# Altium schematic sheet 02_IO_PORTS.SchDoc: General IO Ports
size 381 x 266 mm; Organization: Meteroi; Address1: Room 428, 410 Guiping Rd.; Address2: Shanghai 200233, CHINA; SheetNumber: 2; SheetTotal: 9; PageSetup: Record=PageOptions|CenterHorizontal=True|CenterVertical=True|PrintScale=0.75|XCorrection=1.00|YCorrection=1.00|PrintKind=2|BorderSize=5000000|LeftOffset=0|BottomOffset=0|Orientation=2|PaperLength=1000|PaperWidth=1000|Scale=100|PaperSource=276|PrintQuality=-3|MediaType=1|DitherType=10|PaperKind=A4|PrintScaleMode=1
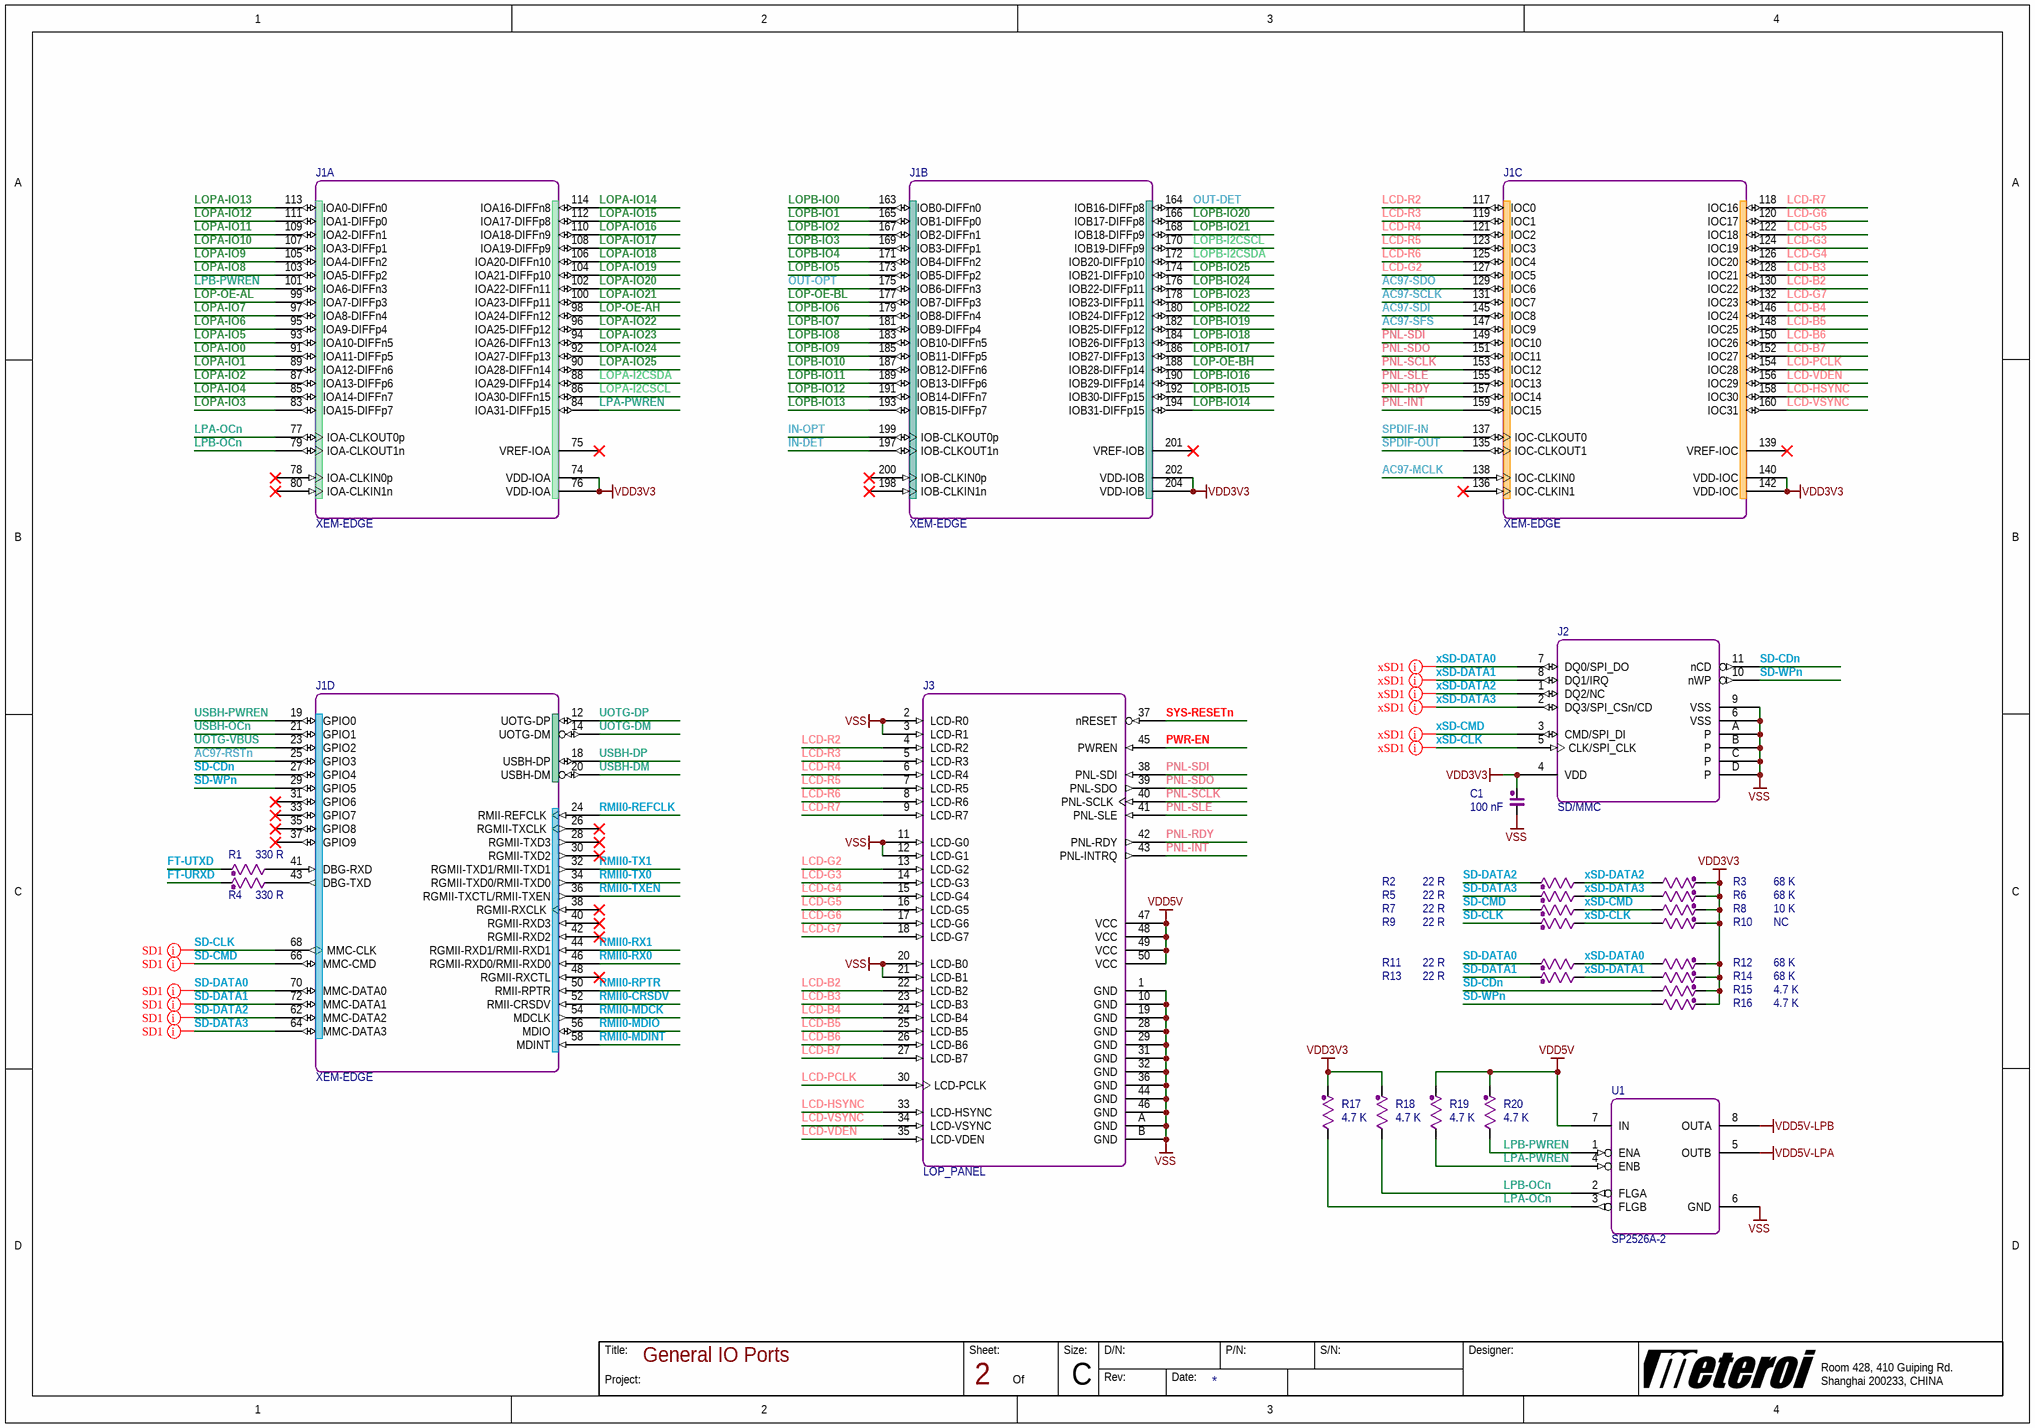
[diagram p0: 02_IO_PORTS.SchDoc]

## Parts
C1  100 nF  [0603A1]
J1  XEM-EDGE  [XEM-1S-204]  (parts A,B,C,D of 5)
J2  SD/MMC  [SD_SOCKET_C]
J3  LOP_PANEL  [FPC_0P5_50A]
R1  330 R  [0603A2]
R2  22 R  [0402A2]
R3  68 K  [0402A2]
R4  330 R  [0603A2]
R5  22 R  [0402A2]
R6  68 K  [0402A2]
R7  22 R  [0402A2]
R8  10 K  [0402A2]
R9  22 R  [0402A2]
R10  NC  [0402A2]
R11  22 R  [0402A2]
R12  68 K  [0402A2]
R13  22 R  [0402A2]
R14  68 K  [0402A2]
R15  4.7 K  [0603A2]
R16  4.7 K  [0603A2]
R17  4.7 K  [0402A2]
R18  4.7 K  [0402A2]
R19  4.7 K  [0603A2]
R20  4.7 K  [0603A2]
U1  SP2526A-2  [SOIC-8S]

## Nets
VDD3V3: C1.2 J1.74(VDD-IOA) J1.76(VDD-IOA) J1.140(VDD-IOC) J1.142(VDD-IOC) J1.202(VDD-IOB) J1.204(VDD-IOB) J2.4(VDD) R3.2 R6.2 R8.2 R10.2 R12.2 R14.2 R15.2 R16.2 R17.2 R18.2
VDD5V: J3.47(VCC) J3.48(VCC) J3.49(VCC) J3.50(VCC) R19.2 R20.2 U1.7(IN)
VDD5V-LPA: U1.5(OUTB)
VDD5V-LPB: U1.8(OUTA)
VSS: C1.1 J2.6(VSS) J2.9(VSS) J2.A(P) J2.B(P) J2.C(P) J2.D(P) J3.1(GND) J3.2(LCD-R0) J3.3(LCD-R1) J3.10(GND) J3.11(LCD-G0) J3.12(LCD-G1) J3.19(GND) J3.20(LCD-B0) J3.21(LCD-B1) J3.28(GND) J3.29(GND) J3.31(GND) J3.32(GND) J3.36(GND) J3.44(GND) J3.46(GND) J3.A(GND) J3.B(GND) U1.6(GND)
AC97-MCLK: J1.138(IOC-CLKIN0)
AC97-RSTn: J1.25(GPIO3)
AC97-SCLK: J1.131(IOC7)
AC97-SDI: J1.145(IOC8)
AC97-SDO: J1.129(IOC6)
AC97-SFS: J1.147(IOC9)
FT-URXD: R4.2
FT-UTXD: R1.2
IN-DET: J1.197(IOB-CLKOUT1n)
IN-OPT: J1.199(IOB-CLKOUT0p)
LCD-B2: J1.130(IOC22) J3.22(LCD-B2)
LCD-B3: J1.128(IOC21) J3.23(LCD-B3)
LCD-B4: J1.146(IOC24) J3.24(LCD-B4)
LCD-B5: J1.148(IOC25) J3.25(LCD-B5)
LCD-B6: J1.150(IOC26) J3.26(LCD-B6)
LCD-B7: J1.152(IOC27) J3.27(LCD-B7)
LCD-G2: J1.127(IOC5) J3.13(LCD-G2)
LCD-G3: J1.124(IOC19) J3.14(LCD-G3)
LCD-G4: J1.126(IOC20) J3.15(LCD-G4)
LCD-G5: J1.122(IOC18) J3.16(LCD-G5)
LCD-G6: J1.120(IOC17) J3.17(LCD-G6)
LCD-G7: J1.132(IOC23) J3.18(LCD-G7)
LCD-HSYNC: J1.158(IOC30) J3.33(LCD-HSYNC)
LCD-PCLK: J1.154(IOC28) J3.30(LCD-PCLK)
LCD-R2: J1.117(IOC0) J3.4(LCD-R2)
LCD-R3: J1.119(IOC1) J3.5(LCD-R3)
LCD-R4: J1.121(IOC2) J3.6(LCD-R4)
LCD-R5: J1.123(IOC3) J3.7(LCD-R5)
LCD-R6: J1.125(IOC4) J3.8(LCD-R6)
LCD-R7: J1.118(IOC16) J3.9(LCD-R7)
LCD-VDEN: J1.156(IOC29) J3.35(LCD-VDEN)
LCD-VSYNC: J1.160(IOC31) J3.34(LCD-VSYNC)
LOP-OE-AH: J1.98(IOA24-DIFFn12)
LOP-OE-AL: J1.99(IOA7-DIFFp3)
LOP-OE-BH: J1.188(IOB28-DIFFp14)
LOP-OE-BL: J1.177(IOB7-DIFFp3)
LOPA-I2CSCL: J1.86(IOA30-DIFFn15)
LOPA-I2CSDA: J1.88(IOA29-DIFFp14)
LOPA-IO0: J1.91(IOA11-DIFFp5)
LOPA-IO1: J1.89(IOA12-DIFFn6)
LOPA-IO2: J1.87(IOA13-DIFFp6)
LOPA-IO3: J1.83(IOA15-DIFFp7)
LOPA-IO4: J1.85(IOA14-DIFFn7)
LOPA-IO5: J1.93(IOA10-DIFFn5)
LOPA-IO6: J1.95(IOA9-DIFFp4)
LOPA-IO7: J1.97(IOA8-DIFFn4)
LOPA-IO8: J1.103(IOA5-DIFFp2)
LOPA-IO9: J1.105(IOA4-DIFFn2)
LOPA-IO10: J1.107(IOA3-DIFFp1)
LOPA-IO11: J1.109(IOA2-DIFFn1)
LOPA-IO12: J1.111(IOA1-DIFFp0)
LOPA-IO13: J1.113(IOA0-DIFFn0)
LOPA-IO14: J1.114(IOA16-DIFFn8)
LOPA-IO15: J1.112(IOA17-DIFFp8)
LOPA-IO16: J1.110(IOA18-DIFFn9)
LOPA-IO17: J1.108(IOA19-DIFFp9)
LOPA-IO18: J1.106(IOA20-DIFFn10)
LOPA-IO19: J1.104(IOA21-DIFFp10)
LOPA-IO20: J1.102(IOA22-DIFFn11)
LOPA-IO21: J1.100(IOA23-DIFFp11)
LOPA-IO22: J1.96(IOA25-DIFFp12)
LOPA-IO23: J1.94(IOA26-DIFFn13)
LOPA-IO24: J1.92(IOA27-DIFFp13)
LOPA-IO25: J1.90(IOA28-DIFFn14)
LOPB-I2CSCL: J1.170(IOB19-DIFFp9)
LOPB-I2CSDA: J1.172(IOB20-DIFFp10)
LOPB-IO0: J1.163(IOB0-DIFFn0)
LOPB-IO1: J1.165(IOB1-DIFFp0)
LOPB-IO2: J1.167(IOB2-DIFFn1)
LOPB-IO3: J1.169(IOB3-DIFFp1)
LOPB-IO4: J1.171(IOB4-DIFFn2)
LOPB-IO5: J1.173(IOB5-DIFFp2)
LOPB-IO6: J1.179(IOB8-DIFFn4)
LOPB-IO7: J1.181(IOB9-DIFFp4)
LOPB-IO8: J1.183(IOB10-DIFFn5)
LOPB-IO9: J1.185(IOB11-DIFFp5)
LOPB-IO10: J1.187(IOB12-DIFFn6)
LOPB-IO11: J1.189(IOB13-DIFFp6)
LOPB-IO12: J1.191(IOB14-DIFFn7)
LOPB-IO13: J1.193(IOB15-DIFFp7)
LOPB-IO14: J1.194(IOB31-DIFFp15)
LOPB-IO15: J1.192(IOB30-DIFFp15)
LOPB-IO16: J1.190(IOB29-DIFFp14)
LOPB-IO17: J1.186(IOB27-DIFFp13)
LOPB-IO18: J1.184(IOB26-DIFFp13)
LOPB-IO19: J1.182(IOB25-DIFFp12)
LOPB-IO20: J1.166(IOB17-DIFFp8)
LOPB-IO21: J1.168(IOB18-DIFFp9)
LOPB-IO22: J1.180(IOB24-DIFFp12)
LOPB-IO23: J1.178(IOB23-DIFFp11)
LOPB-IO24: J1.176(IOB22-DIFFp11)
LOPB-IO25: J1.174(IOB21-DIFFp10)
LPA-OCn: J1.77(IOA-CLKOUT0p) R17.1 U1.3(FLGB)
LPA-PWREN: J1.84(IOA31-DIFFp15) R19.1 U1.4(ENB)
LPB-OCn: J1.79(IOA-CLKOUT1n) R18.1 U1.2(FLGA)
LPB-PWREN: J1.101(IOA6-DIFFn3) R20.1 U1.1(ENA)
OUT-DET: J1.164(IOB16-DIFFp8)
OUT-OPT: J1.175(IOB6-DIFFn3)
PNL-INT: J1.159(IOC15) J3.43(PNL-INTRQ)
PNL-RDY: J1.157(IOC14) J3.42(PNL-RDY)
PNL-SCLK: J1.153(IOC12) J3.40(PNL-SCLK)
PNL-SDI: J1.149(IOC10) J3.38(PNL-SDI)
PNL-SDO: J1.151(IOC11) J3.39(PNL-SDO)
PNL-SLE: J1.155(IOC13) J3.41(PNL-SLE)
PWR-EN: J3.45(PWREN)
RMII0-CRSDV: J1.52(RMII-CRSDV)
RMII0-MDCK: J1.54(MDCLK)
RMII0-MDINT: J1.58(MDINT)
RMII0-MDIO: J1.56(MDIO)
RMII0-REFCLK: J1.24(RMII-REFCLK)
RMII0-RPTR: J1.50(RMII-RPTR)
RMII0-RX0: J1.46(RGMII-RXD0/RMII-RXD0)
RMII0-RX1: J1.44(RGMII-RXD1/RMII-RXD1)
RMII0-TX0: J1.34(RGMII-TXD0/RMII-TXD0)
RMII0-TX1: J1.32(RGMII-TXD1/RMII-TXD1)
RMII0-TXEN: J1.36(RGMII-TXCTL/RMII-TXEN)
SD-CDn: J1.27(GPIO4) J2.11(nCD) R15.1
SD-CLK: J1.68(MMC-CLK) R9.2
SD-CMD: J1.66(MMC-CMD) R7.2
SD-DATA0: J1.70(MMC-DATA0) R11.2
SD-DATA1: J1.72(MMC-DATA1) R13.2
SD-DATA2: J1.62(MMC-DATA2) R2.2
SD-DATA3: J1.64(MMC-DATA3) R5.2
SD-WPn: J1.29(GPIO5) J2.10(nWP) R16.1
SPDIF-IN: J1.137(IOC-CLKOUT0)
SPDIF-OUT: J1.135(IOC-CLKOUT1)
SYS-RESETn: J3.37(nRESET)
UOTG-DM: J1.14(UOTG-DM)
UOTG-DP: J1.12(UOTG-DP)
UOTG-VBUS: J1.23(GPIO2)
USBH-DM: J1.20(USBH-DM)
USBH-DP: J1.18(USBH-DP)
USBH-OCn: J1.21(GPIO1)
USBH-PWREN: J1.19(GPIO0)
xSD-CLK: J2.5(CLK/SPI_CLK) R9.1 R10.1
xSD-CMD: J2.3(CMD/SPI_DI) R7.1 R8.1
xSD-DATA0: J2.7(DQ0/SPI_DO) R11.1 R12.1
xSD-DATA1: J2.8(DQ1/IRQ) R13.1 R14.1
xSD-DATA2: J2.1(DQ2/NC) R2.1 R3.1
xSD-DATA3: J2.2(DQ3/SPI_CSn/CD) R5.1 R6.1
NetJ1_41: J1.41(DBG-RXD) R1.1
NetJ1_43: J1.43(DBG-TXD) R4.1

Not connected (* = marked no-connect by the designer): J1 26(RGMII-TXCLK)* 28(RGMII-TXD3)* 30(RGMII-TXD2)* 31(GPIO6)* 33(GPIO7)* 35(GPIO8)* 37(GPIO9)* 38(RGMII-RXCLK)* 40(RGMII-RXD3)* 42(RGMII-RXD2)* 48(RGMII-RXCTL)* 75(VREF-IOA)* 78(IOA-CLKIN0p)* 80(IOA-CLKIN1n)* 136(IOC-CLKIN1)* 139(VREF-IOC)* 198(IOB-CLKIN1n)* 200(IOB-CLKIN0p)* 201(VREF-IOB)*

## Layout directives
net class xSD1: xSD-CLK, xSD-CMD, xSD-DATA0, xSD-DATA1, xSD-DATA2, xSD-DATA3
net class SD1: SD-CLK, SD-CMD, SD-DATA0, SD-DATA1, SD-DATA2, SD-DATA3

## Notes on the sheet
- Title:
- Project:
- Sheet:
- Of
- Size:
- D/N:
- Rev:
- Date:
- P/N:
- S/N:
- Designer:
- C

## Library data of the parts
C1 = CAP: Normal Capacitor; PartNumber: 0; Vendor: muRata; Designer: shyul; PinCountSMD: 2; Value: 100 nF; SerialNumber: 0; Publisher: Cowin; PCBMarker: Capacitor; Version: 1.0; VersionDate: 04-27-2011; PinCountHole: 0
J1 = XEM-SLOT: XEM Edge Connector 204-pins; Vendor: Cowin; PinCountSMD: 0; Designer: shyul; Value: XEM-EDGE; PartNumber: XEM-EDGE; Version: 1.0; VersionDate: 03-09-2012; PinCountHole: 0; SerialNumber: 0; Publisher: Cowin; PCBMarker: XEM
J2 = SD_JACK_2: SD/MMC CARD Socket; PartNumber: 2041021-1; SerialNumber: 0; Vendor: Tyco; PinCountSMD: 15; Designer: shyul; PCBMarker: SD/MMC; PinCountHole: 0; Value: SD/MMC; Version: 1.0; VersionDate: 05-10-2011; Publisher: Cowin
J3 = LOP_PANEL: Lophilo Panel Interface; Vendor: 0; PinCountHole: 52; Designer: shyul; Value: LOP_PANEL; PartNumber: LOP_PANEL; Version: 1.0; VersionDate: 06-03-2012; PinCountSMD: 0; SerialNumber: 0; Publisher: Cowin; PCBMarker: LOP_PANEL
R1-R20 = RES: Normal Resistor; PartNumber: 0; Vendor: KOA; Designer: shyul; PinCountSMD: 2; SerialNumber: 0; Version: 1.0; VersionDate: 04-27-2011; PCBMarker: Resistor; Publisher: Cowin; PinCountHole: 0
  R1 R4: Value: 330 R
  R2 R5 R7 R9 R11 R13: Value: 22 R
  R3 R6 R12 R14: Value: 68 K
  R8: Value: 10 K
  R10: Value: NC
  R15-R20: Value: 4.7 K
U1 = SP2526A-2: Power Switch; PartNumber: SP2526A-2EN; Vendor: EXAR; PinCountSMD: 29; PinCountHole: 0; Designer: shyul; PCBMarker: PHY; Value: SP2526A-2; Version: 1.0; VersionDate: 03-26-2012; SerialNumber: 0; Publisher: Cowin